# Altium schematic sheet TD4_CPU.SchDoc
size 533 x 393 mm
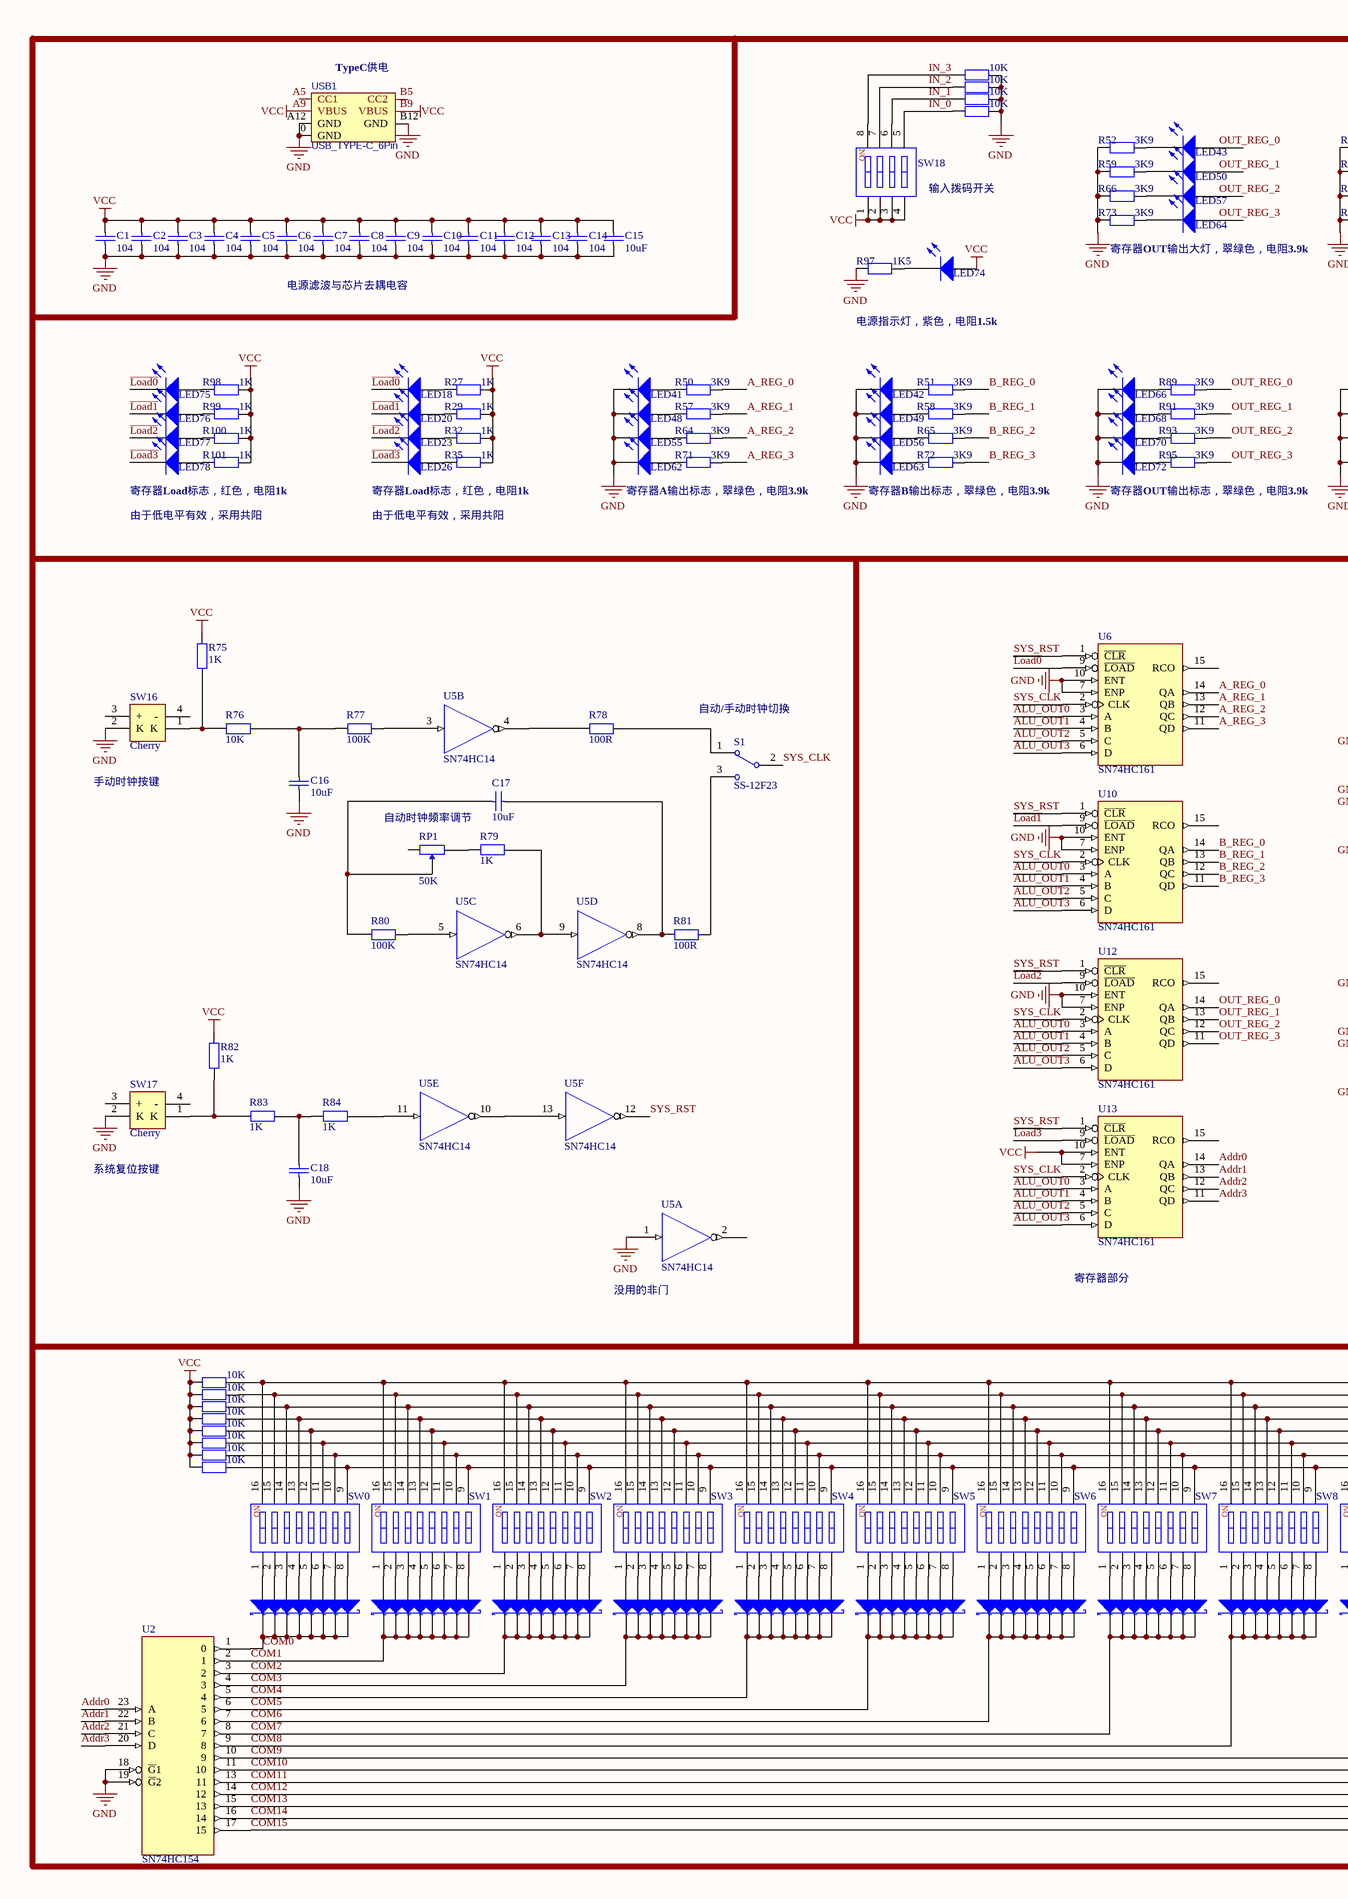
[diagram p0: TD4_CPU.SchDoc, left]
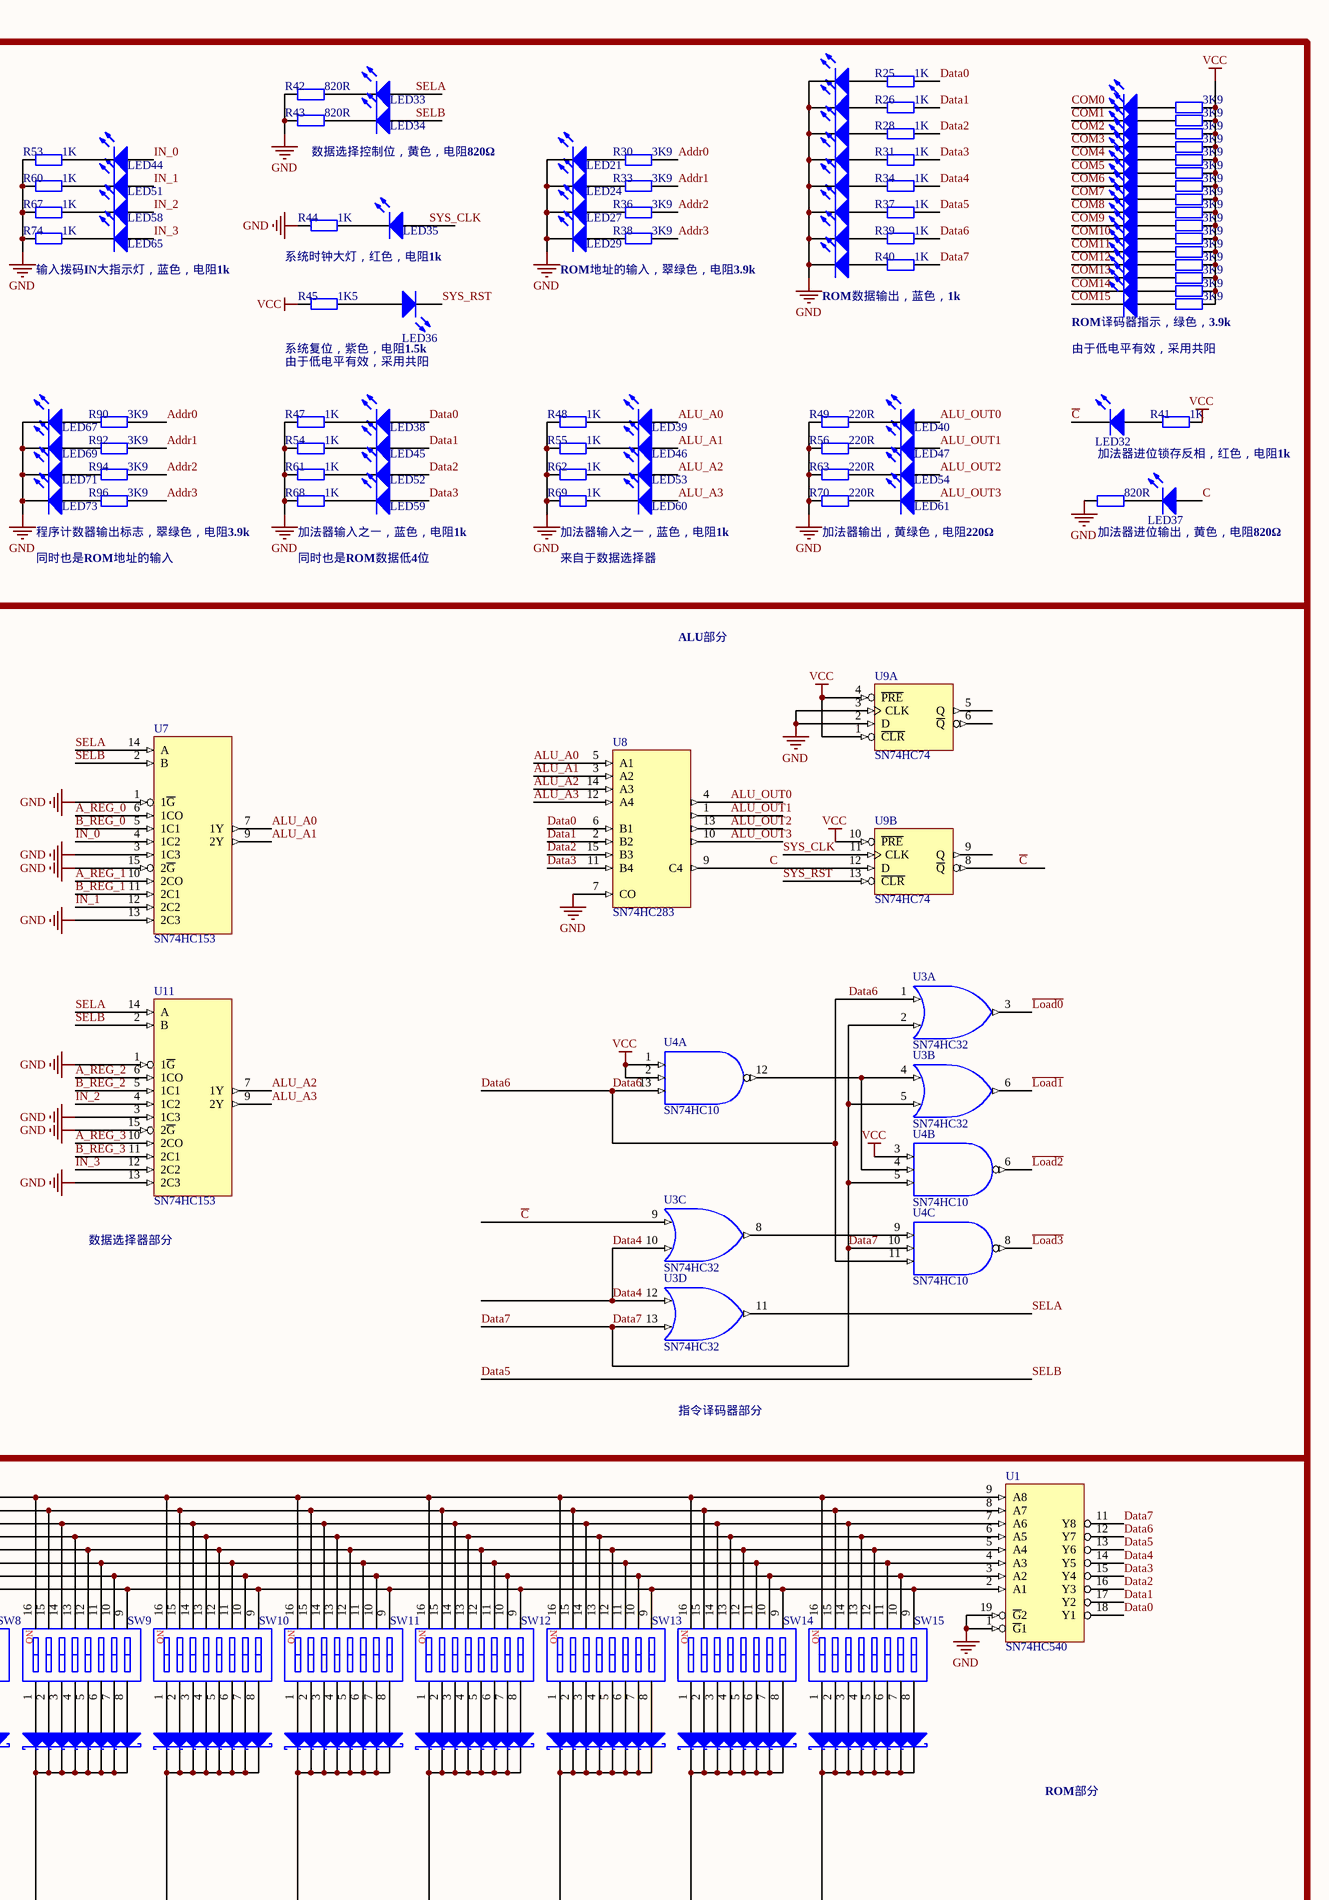
[diagram p1: TD4_CPU.SchDoc, right]

## Parts
C1  104  [C0805_L]
C2  104  [C0805_L]
C3  104  [C0805_L]
C4  104  [C0805_L]
C5  104  [C0805_L]
C6  104  [C0805_L]
C7  104  [C0805_L]
C8  104  [C0805_L]
C9  104  [C0805_L]
C10  104  [C0805_L]
C11  104  [C0805_L]
C12  104  [C0805_L]
C13  104  [C0805_L]
C14  104  [C0805_L]
C15  10uF  [C0805_L]
C16  10uF  [C0805_L]
C17  10uF  [C0805_L]
C18  10uF  [C0805_L]
D1  SS14  [SOD-123]  (value not drawn)
D2  SS14  [SOD-123]  (value not drawn)
D3  SS14  [SOD-123]  (value not drawn)
D4  SS14  [SOD-123]  (value not drawn)
D5  SS14  [SOD-123]  (value not drawn)
D6  SS14  [SOD-123]  (value not drawn)
D7  SS14  [SOD-123]  (value not drawn)
D8  SS14  [SOD-123]  (value not drawn)
D9  SS14  [SOD-123]  (value not drawn)
D10  SS14  [SOD-123]  (value not drawn)
D11  SS14  [SOD-123]  (value not drawn)
D12  SS14  [SOD-123]  (value not drawn)
D13  SS14  [SOD-123]  (value not drawn)
D14  SS14  [SOD-123]  (value not drawn)
D15  SS14  [SOD-123]  (value not drawn)
D16  SS14  [SOD-123]  (value not drawn)
D17  SS14  [SOD-123]  (value not drawn)
D18  SS14  [SOD-123]  (value not drawn)
D19  SS14  [SOD-123]  (value not drawn)
D20  SS14  [SOD-123]  (value not drawn)
D21  SS14  [SOD-123]  (value not drawn)
D22  SS14  [SOD-123]  (value not drawn)
D23  SS14  [SOD-123]  (value not drawn)
D24  SS14  [SOD-123]  (value not drawn)
D25  SS14  [SOD-123]  (value not drawn)
D26  SS14  [SOD-123]  (value not drawn)
D27  SS14  [SOD-123]  (value not drawn)
D28  SS14  [SOD-123]  (value not drawn)
D29  SS14  [SOD-123]  (value not drawn)
D30  SS14  [SOD-123]  (value not drawn)
D31  SS14  [SOD-123]  (value not drawn)
D32  SS14  [SOD-123]  (value not drawn)
D33  SS14  [SOD-123]  (value not drawn)
D34  SS14  [SOD-123]  (value not drawn)
D35  SS14  [SOD-123]  (value not drawn)
D36  SS14  [SOD-123]  (value not drawn)
D37  SS14  [SOD-123]  (value not drawn)
D38  SS14  [SOD-123]  (value not drawn)
D39  SS14  [SOD-123]  (value not drawn)
D40  SS14  [SOD-123]  (value not drawn)
D41  SS14  [SOD-123]  (value not drawn)
D42  SS14  [SOD-123]  (value not drawn)
D43  SS14  [SOD-123]  (value not drawn)
D44  SS14  [SOD-123]  (value not drawn)
D45  SS14  [SOD-123]  (value not drawn)
D46  SS14  [SOD-123]  (value not drawn)
D47  SS14  [SOD-123]  (value not drawn)
D48  SS14  [SOD-123]  (value not drawn)
D49  SS14  [SOD-123]  (value not drawn)
D50  SS14  [SOD-123]  (value not drawn)
D51  SS14  [SOD-123]  (value not drawn)
D52  SS14  [SOD-123]  (value not drawn)
D53  SS14  [SOD-123]  (value not drawn)
D54  SS14  [SOD-123]  (value not drawn)
D55  SS14  [SOD-123]  (value not drawn)
D56  SS14  [SOD-123]  (value not drawn)
D57  SS14  [SOD-123]  (value not drawn)
D58  SS14  [SOD-123]  (value not drawn)
D59  SS14  [SOD-123]  (value not drawn)
D60  SS14  [SOD-123]  (value not drawn)
D61  SS14  [SOD-123]  (value not drawn)
D62  SS14  [SOD-123]  (value not drawn)
D63  SS14  [SOD-123]  (value not drawn)
D64  SS14  [SOD-123]  (value not drawn)
D65  SS14  [SOD-123]  (value not drawn)
D66  SS14  [SOD-123]  (value not drawn)
D67  SS14  [SOD-123]  (value not drawn)
D68  SS14  [SOD-123]  (value not drawn)
D69  SS14  [SOD-123]  (value not drawn)
D70  SS14  [SOD-123]  (value not drawn)
D71  SS14  [SOD-123]  (value not drawn)
D72  SS14  [SOD-123]  (value not drawn)
D73  SS14  [SOD-123]  (value not drawn)
D74  SS14  [SOD-123]  (value not drawn)
D75  SS14  [SOD-123]  (value not drawn)
D76  SS14  [SOD-123]  (value not drawn)
D77  SS14  [SOD-123]  (value not drawn)
D78  SS14  [SOD-123]  (value not drawn)
D79  SS14  [SOD-123]  (value not drawn)
D80  SS14  [SOD-123]  (value not drawn)
D81  SS14  [SOD-123]  (value not drawn)
D82  SS14  [SOD-123]  (value not drawn)
D83  SS14  [SOD-123]  (value not drawn)
D84  SS14  [SOD-123]  (value not drawn)
D85  SS14  [SOD-123]  (value not drawn)
D86  SS14  [SOD-123]  (value not drawn)
D87  SS14  [SOD-123]  (value not drawn)
D88  SS14  [SOD-123]  (value not drawn)
D89  SS14  [SOD-123]  (value not drawn)
D90  SS14  [SOD-123]  (value not drawn)
D91  SS14  [SOD-123]  (value not drawn)
D92  SS14  [SOD-123]  (value not drawn)
D93  SS14  [SOD-123]  (value not drawn)
D94  SS14  [SOD-123]  (value not drawn)
D95  SS14  [SOD-123]  (value not drawn)
D96  SS14  [SOD-123]  (value not drawn)
D97  SS14  [SOD-123]  (value not drawn)
D98  SS14  [SOD-123]  (value not drawn)
D99  SS14  [SOD-123]  (value not drawn)
D100  SS14  [SOD-123]  (value not drawn)
D101  SS14  [SOD-123]  (value not drawn)
D102  SS14  [SOD-123]  (value not drawn)
D103  SS14  [SOD-123]  (value not drawn)
D104  SS14  [SOD-123]  (value not drawn)
D105  SS14  [SOD-123]  (value not drawn)
D106  SS14  [SOD-123]  (value not drawn)
D107  SS14  [SOD-123]  (value not drawn)
D108  SS14  [SOD-123]  (value not drawn)
D109  SS14  [SOD-123]  (value not drawn)
D110  SS14  [SOD-123]  (value not drawn)
D111  SS14  [SOD-123]  (value not drawn)
D112  SS14  [SOD-123]  (value not drawn)
D113  SS14  [SOD-123]  (value not drawn)
D114  SS14  [SOD-123]  (value not drawn)
D115  SS14  [SOD-123]  (value not drawn)
D116  SS14  [SOD-123]  (value not drawn)
D117  SS14  [SOD-123]  (value not drawn)
D118  SS14  [SOD-123]  (value not drawn)
D119  SS14  [SOD-123]  (value not drawn)
D120  SS14  [SOD-123]  (value not drawn)
D121  SS14  [SOD-123]  (value not drawn)
D122  SS14  [SOD-123]  (value not drawn)
D123  SS14  [SOD-123]  (value not drawn)
D124  SS14  [SOD-123]  (value not drawn)
D125  SS14  [SOD-123]  (value not drawn)
D126  SS14  [SOD-123]  (value not drawn)
D127  SS14  [SOD-123]  (value not drawn)
D128  SS14  [SOD-123]  (value not drawn)
LED0  绿色  [LED0805_B]  (value not drawn)
LED1  绿色  [LED0805_B]  (value not drawn)
LED2  绿色  [LED0805_B]  (value not drawn)
LED3  绿色  [LED0805_B]  (value not drawn)
LED4  绿色  [LED0805_B]  (value not drawn)
LED5  绿色  [LED0805_B]  (value not drawn)
LED6  绿色  [LED0805_B]  (value not drawn)
LED7  绿色  [LED0805_B]  (value not drawn)
LED8  绿色  [LED0805_B]  (value not drawn)
LED9  绿色  [LED0805_B]  (value not drawn)
LED10  绿色  [LED0805_B]  (value not drawn)
LED11  绿色  [LED0805_B]  (value not drawn)
LED12  绿色  [LED0805_B]  (value not drawn)
LED13  绿色  [LED0805_B]  (value not drawn)
LED14  绿色  [LED0805_B]  (value not drawn)
LED15  绿色  [LED0805_B]  (value not drawn)
LED16  蓝色  [LED0805_B]  (value not drawn)
LED17  蓝色  [LED0805_B]  (value not drawn)
LED18  红色  [LED0805_B]  (value not drawn)
LED19  蓝色  [LED0805_B]  (value not drawn)
LED20  红色  [LED0805_B]  (value not drawn)
LED21  绿色  [LED0805_B]  (value not drawn)
LED22  蓝色  [LED0805_B]  (value not drawn)
LED23  红色  [LED0805_B]  (value not drawn)
LED24  绿色  [LED0805_B]  (value not drawn)
LED25  蓝色  [LED0805_B]  (value not drawn)
LED26  红色  [LED0805_B]  (value not drawn)
LED27  绿色  [LED0805_B]  (value not drawn)
LED28  蓝色  [LED0805_B]  (value not drawn)
LED29  绿色  [LED0805_B]  (value not drawn)
LED30  蓝色  [LED0805_B]  (value not drawn)
LED31  蓝色  [LED0805_B]  (value not drawn)
LED32  红色  [LED0805_B]  (value not drawn)
LED33  黄色  [LED0805_B]  (value not drawn)
LED34  黄色  [LED0805_B]  (value not drawn)
LED35  红色  [LED F257-W - duplicate]  (value not drawn)
LED36  紫色  [LED0805_B]  (value not drawn)
LED37  黄色  [LED0805_B]  (value not drawn)
LED38  蓝色  [LED0805_B]  (value not drawn)
LED39  红色  [LED0805_B]  (value not drawn)
LED40  黄绿色  [LED0805_B]  (value not drawn)
LED41  绿色  [LED0805_B]  (value not drawn)
LED42  绿色  [LED0805_B]  (value not drawn)
LED43  绿色  [LED F257-W - duplicate]  (value not drawn)
LED44  蓝色  [LED F257-W - duplicate]  (value not drawn)
LED45  蓝色  [LED0805_B]  (value not drawn)
LED46  红色  [LED0805_B]  (value not drawn)
LED47  黄绿色  [LED0805_B]  (value not drawn)
LED48  绿色  [LED0805_B]  (value not drawn)
LED49  绿色  [LED0805_B]  (value not drawn)
LED50  绿色  [LED F257-W - duplicate]  (value not drawn)
LED51  蓝色  [LED F257-W - duplicate]  (value not drawn)
LED52  蓝色  [LED0805_B]  (value not drawn)
LED53  红色  [LED0805_B]  (value not drawn)
LED54  黄绿色  [LED0805_B]  (value not drawn)
LED55  绿色  [LED0805_B]  (value not drawn)
LED56  绿色  [LED0805_B]  (value not drawn)
LED57  绿色  [LED F257-W - duplicate]  (value not drawn)
LED58  蓝色  [LED F257-W - duplicate]  (value not drawn)
LED59  蓝色  [LED0805_B]  (value not drawn)
LED60  红色  [LED0805_B]  (value not drawn)
LED61  黄绿色  [LED0805_B]  (value not drawn)
LED62  绿色  [LED0805_B]  (value not drawn)
LED63  绿色  [LED0805_B]  (value not drawn)
LED64  绿色  [LED F257-W - duplicate]  (value not drawn)
LED65  蓝色  [LED F257-W - duplicate]  (value not drawn)
LED66  绿色  [LED0805_B]  (value not drawn)
LED67  绿色  [LED0805_B]  (value not drawn)
LED68  绿色  [LED0805_B]  (value not drawn)
LED69  绿色  [LED0805_B]  (value not drawn)
LED70  绿色  [LED0805_B]  (value not drawn)
LED71  绿色  [LED0805_B]  (value not drawn)
LED72  绿色  [LED0805_B]  (value not drawn)
LED73  绿色  [LED0805_B]  (value not drawn)
LED74  紫色  [LED0805_B]  (value not drawn)
LED75  红色  [LED0805_B]  (value not drawn)
LED76  红色  [LED0805_B]  (value not drawn)
LED77  红色  [LED0805_B]  (value not drawn)
LED78  红色  [LED0805_B]  (value not drawn)
R1  10K  [R0805_L]
R2  10K  [R0805_L]
R3  10K  [R0805_L]
R4  10K  [R0805_L]
R5  10K  [R0805_L]
R6  10K  [R0805_L]
R7  10K  [R0805_L]
R8  10K  [R0805_L]
R9  3K9  [R0805_L]
R10  3K9  [R0805_L]
R11  3K9  [R0805_L]
R12  3K9  [R0805_L]
R13  3K9  [R0805_L]
R14  3K9  [R0805_L]
R15  3K9  [R0805_L]
R16  3K9  [R0805_L]
R17  3K9  [R0805_L]
R18  3K9  [R0805_L]
R19  3K9  [R0805_L]
R20  3K9  [R0805_L]
R21  3K9  [R0805_L]
R22  3K9  [R0805_L]
R23  3K9  [R0805_L]
R24  3K9  [R0805_L]
R25  1K  [R0805_L]
R26  1K  [R0805_L]
R27  1K  [R0805_L]
R28  1K  [R0805_L]
R29  1K  [R0805_L]
R30  3K9  [R0805_L]
R31  1K  [R0805_L]
R32  1K  [R0805_L]
R33  3K9  [R0805_L]
R34  1K  [R0805_L]
R35  1K  [R0805_L]
R36  3K9  [R0805_L]
R37  1K  [R0805_L]
R38  3K9  [R0805_L]
R39  1K  [R0805_L]
R40  1K  [R0805_L]
R41  1K  [R0805_L]
R42  820R  [R0805_L]
R43  820R  [R0805_L]
R44  1K  [R0805_L]
R45  1K5  [R0805_L]
R46  820R  [R0805_L]
R47  1K  [R0805_L]
R48  1K  [R0805_L]
R49  220R  [R0805_L]
R50  3K9  [R0805_L]
R51  3K9  [R0805_L]
R52  3K9  [R0805_L]
R53  1K  [R0805_L]
R54  1K  [R0805_L]
R55  1K  [R0805_L]
R56  220R  [R0805_L]
R57  3K9  [R0805_L]
R58  3K9  [R0805_L]
R59  3K9  [R0805_L]
R60  1K  [R0805_L]
R61  1K  [R0805_L]
R62  1K  [R0805_L]
R63  220R  [R0805_L]
R64  3K9  [R0805_L]
R65  3K9  [R0805_L]
R66  3K9  [R0805_L]
R67  1K  [R0805_L]
R68  1K  [R0805_L]
R69  1K  [R0805_L]
R70  220R  [R0805_L]
R71  3K9  [R0805_L]
R72  3K9  [R0805_L]
R73  3K9  [R0805_L]
R74  1K  [R0805_L]
R75  1K  [R0805_L]
R76  10K  [R0805_L]
R77  100K  [R0805_L]
R78  100R  [R0805_L]
R79  1K  [R0805_L]
R80  100K  [R0805_L]
R81  100R  [R0805_L]
R82  1K  [R0805_L]
R83  1K  [R0805_L]
R84  1K  [R0805_L]
R85  10K  [R0805_L]
R86  10K  [R0805_L]
R87  10K  [R0805_L]
R88  10K  [R0805_L]
R89  3K9  [R0805_L]
R90  3K9  [R0805_L]
R91  3K9  [R0805_L]
R92  3K9  [R0805_L]
R93  3K9  [R0805_L]
R94  3K9  [R0805_L]
R95  3K9  [R0805_L]
R96  3K9  [R0805_L]
R97  1K5  [R0805_L]
R98  1K  [R0805_L]
R99  1K  [R0805_L]
R100  1K  [R0805_L]
R101  1K  [R0805_L]
RP1  50K  [XV09223NPV-20F]
S1  SS-12F23  [SS-12D10]
SW0  DIP-SW-8P  [SW DIP-8P-B]  (value not drawn)
SW1  DIP-SW-8P  [SW DIP-8P-B]  (value not drawn)
SW2  DIP-SW-8P  [SW DIP-8P-B]  (value not drawn)
SW3  DIP-SW-8P  [SW DIP-8P-B]  (value not drawn)
SW4  DIP-SW-8P  [SW DIP-8P-B]  (value not drawn)
SW5  DIP-SW-8P  [SW DIP-8P-B]  (value not drawn)
SW6  DIP-SW-8P  [SW DIP-8P-B]  (value not drawn)
SW7  DIP-SW-8P  [SW DIP-8P-B]  (value not drawn)
SW8  DIP-SW-8P  [SW DIP-8P-B]  (value not drawn)
SW9  DIP-SW-8P  [SW DIP-8P-B]  (value not drawn)
SW10  DIP-SW-8P  [SW DIP-8P-B]  (value not drawn)
SW11  DIP-SW-8P  [SW DIP-8P-B]  (value not drawn)
SW12  DIP-SW-8P  [SW DIP-8P-B]  (value not drawn)
SW13  DIP-SW-8P  [SW DIP-8P-B]  (value not drawn)
SW14  DIP-SW-8P  [SW DIP-8P-B]  (value not drawn)
SW15  DIP-SW-8P  [SW DIP-8P-B]  (value not drawn)
SW16  Cherry  [LSW DIP-CHERRY-Hat]
SW17  Cherry  [LSW DIP-CHERRY-Hat]
SW18  DIP-SW-4P  [SW DIP-4P-B]  (value not drawn)
U1  SN74HC540  [DIP20-300_MH]
U2  SN74HC154  [DIP24-300_MH]
U3  SN74HC32  [DIP14-300_MH]  (parts A,B,C,D of 4)
U4  SN74HC10  [DIP14-300_MH]  (parts A,B,C of 3)
U5  SN74HC14  [DIP14-300_MH]  (parts A,B,C,D,E,F of 6)
U6  SN74HC161  [DIP16-300_MH]
U7  SN74HC153  [DIP16-300_MH]
U8  SN74HC283  [DIP16-300_MH]
U9  SN74HC74  [DIP14-300_MH]  (parts A,B of 2)
U10  SN74HC161  [DIP16-300_MH]
U11  SN74HC153  [DIP16-300_MH]
U12  SN74HC161  [DIP16-300_MH]
U13  SN74HC161  [DIP16-300_MH]
USB1  USB_TYPE-C_6Pin  [USB-C-SMD_6P]

## Nets
GND: C1.1 C2.1 C3.1 C4.1 C5.1 C6.1 C7.1 C8.1 C9.1 C10.1 C11.1 C12.1 C13.1 C14.1 C15.1 C16.1 C18.1 LED16.2(K) LED17.2(K) LED19.2(K) LED21.2(K) LED22.2(K) LED24.2(K) LED25.2(K) LED27.2(K) LED28.2(K) LED29.2(K) LED30.2(K) LED31.2(K) LED41.2(K) LED42.2(K) LED48.2(K) LED49.2(K) LED55.2(K) LED56.2(K) LED62.2(K) LED63.2(K) LED66.2(K) LED67.2(K) LED68.2(K) LED69.2(K) LED70.2(K) LED71.2(K) LED72.2(K) LED73.2(K) R42.1 R43.1 R44.1 R46.1 R47.1 R48.1 R49.1 R52.1 R53.1 R54.1 R55.1 R56.1 R59.1 R60.1 R61.1 R62.1 R63.1 R66.1 R67.1 R68.1 R69.1 R70.1 R73.1 R74.1 R85.2 R86.2 R87.2 R88.2 R97.1 SW16.2(K) SW17.2(K) U1.1(~{G}1) U1.10(GND) U1.19(~{G}2) U2.12(GND) U2.18(~{G}1) U2.19(~{G}2) U3.7(GND) U4.7(GND) U5.1 U5.7(GND) U6.7(ENP) U6.8(GND) U6.10(ENT) U7.1(1~{G}) U7.3(1C3) U7.8(GND) U7.13(2C3) U7.15(2~{G}) U8.7(CO) U8.8(GND) U9.2(D) U9.3(CLK) U9.7(GND) U10.7(ENP) U10.8(GND) U10.10(ENT) U11.1(1~{G}) U11.3(1C3) U11.8(GND) U11.13(2C3) U11.15(2~{G}) U12.7(ENP) U12.8(GND) U12.10(ENT) U13.8(GND) USB1.0(GND) USB1.A12(GND) USB1.B12(GND)
VCC: C1.2 C2.2 C3.2 C4.2 C5.2 C6.2 C7.2 C8.2 C9.2 C10.2 C11.2 C12.2 C13.2 C14.2 C15.2 LED74.1(A) R1.1 R2.1 R3.1 R4.1 R5.1 R6.1 R7.1 R8.1 R9.2 R10.2 R11.2 R12.2 R13.2 R14.2 R15.2 R16.2 R17.2 R18.2 R19.2 R20.2 R21.2 R22.2 R23.2 R24.2 R27.2 R29.2 R32.2 R35.2 R41.2 R45.1 R75.2 R82.2 R98.2 R99.2 R100.2 R101.2 SW18.1 SW18.2 SW18.3 SW18.4 U1.20(VCC) U2.24(VCC) U3.14(VCC) U4.1 U4.2 U4.3 U4.14(VCC) U5.14(VCC) U6.16(VCC) U7.16(VCC) U8.16(VCC) U9.1(~{CLR}) U9.4(~{PRE}) U9.10(~{PRE}) U9.14(VCC) U10.16(VCC) U11.16(VCC) U12.16(VCC) U13.7(ENP) U13.10(ENT) U13.16(VCC) USB1.A9(VBUS) USB1.B9(VBUS)
A_REG_0: R50.2 U6.14(QA) U7.6(1CO)
A_REG_1: R57.2 U6.13(QB) U7.10(2CO)
A_REG_2: R64.2 U6.12(QC) U11.6(1CO)
A_REG_3: R71.2 U6.11(QD) U11.10(2CO)
Addr0: R30.2 R90.2 U2.23(A) U13.14(QA)
Addr1: R33.2 R92.2 U2.22(B) U13.13(QB)
Addr2: R36.2 R94.2 U2.21(C) U13.12(QC)
Addr3: R38.2 R96.2 U2.20(D) U13.11(QD)
ALU_A0: LED39.1(A) U7.7(1Y) U8.5(A1)
ALU_A1: LED46.1(A) U7.9(2Y) U8.3(A2)
ALU_A2: LED53.1(A) U8.14(A3) U11.7(1Y)
ALU_A3: LED60.1(A) U8.12(A4) U11.9(2Y)
ALU_OUT0: LED40.1(A) U6.3(A) U8.4 U10.3(A) U12.3(A) U13.3(A)
ALU_OUT1: LED47.1(A) U6.4(B) U8.1 U10.4(B) U12.4(B) U13.4(B)
ALU_OUT2: LED54.1(A) U6.5(C) U8.13 U10.5(C) U12.5(C) U13.5(C)
ALU_OUT3: LED61.1(A) U6.6(D) U8.10 U10.6(D) U12.6(D) U13.6(D)
B_REG_0: R51.2 U7.5(1C1) U10.14(QA)
B_REG_1: R58.2 U7.11(2C1) U10.13(QB)
B_REG_2: R65.2 U10.12(QC) U11.5(1C1)
B_REG_3: R72.2 U10.11(QD) U11.11(2C1)
C: LED37.1(A) U8.9(C4) U9.12(D)
~{C}: LED32.2(K) U3.9 U9.8(~{Q})
COM0: D1.2(K) D2.2(K) D3.2(K) D4.2(K) D5.2(K) D6.2(K) D7.2(K) D8.2(K) LED0.2(K) U2.1(0)
COM1: D9.2(K) D10.2(K) D11.2(K) D12.2(K) D13.2(K) D14.2(K) D15.2(K) D16.2(K) LED1.2(K) U2.2(1)
COM2: D17.2(K) D18.2(K) D19.2(K) D20.2(K) D21.2(K) D22.2(K) D23.2(K) D24.2(K) LED2.2(K) U2.3(2)
COM3: D25.2(K) D26.2(K) D27.2(K) D28.2(K) D29.2(K) D30.2(K) D31.2(K) D32.2(K) LED3.2(K) U2.4(3)
COM4: D33.2(K) D34.2(K) D35.2(K) D36.2(K) D37.2(K) D38.2(K) D39.2(K) D40.2(K) LED4.2(K) U2.5(4)
COM5: D41.2(K) D42.2(K) D43.2(K) D44.2(K) D45.2(K) D46.2(K) D47.2(K) D48.2(K) LED5.2(K) U2.6(5)
COM6: D49.2(K) D50.2(K) D51.2(K) D52.2(K) D53.2(K) D54.2(K) D55.2(K) D56.2(K) LED6.2(K) U2.7(6)
COM7: D57.2(K) D58.2(K) D59.2(K) D60.2(K) D61.2(K) D62.2(K) D63.2(K) D64.2(K) LED7.2(K) U2.8(7)
COM8: D65.2(K) D66.2(K) D67.2(K) D68.2(K) D69.2(K) D70.2(K) D71.2(K) D72.2(K) LED8.2(K) U2.9(8)
COM9: D73.2(K) D74.2(K) D75.2(K) D76.2(K) D77.2(K) D78.2(K) D79.2(K) D80.2(K) LED9.2(K) U2.10(9)
COM10: D81.2(K) D82.2(K) D83.2(K) D84.2(K) D85.2(K) D86.2(K) D87.2(K) D88.2(K) LED10.2(K) U2.11(10)
COM11: D89.2(K) D90.2(K) D91.2(K) D92.2(K) D93.2(K) D94.2(K) D95.2(K) D96.2(K) LED11.2(K) U2.13(11)
COM12: D97.2(K) D98.2(K) D99.2(K) D100.2(K) D101.2(K) D102.2(K) D103.2(K) D104.2(K) LED12.2(K) U2.14(12)
COM13: D105.2(K) D106.2(K) D107.2(K) D108.2(K) D109.2(K) D110.2(K) D111.2(K) D112.2(K) LED13.2(K) U2.15(13)
COM14: D113.2(K) D114.2(K) D115.2(K) D116.2(K) D117.2(K) D118.2(K) D119.2(K) D120.2(K) LED14.2(K) U2.16(14)
COM15: D121.2(K) D122.2(K) D123.2(K) D124.2(K) D125.2(K) D126.2(K) D127.2(K) D128.2(K) LED15.2(K) U2.17(15)
Data0: LED38.1(A) R25.2 U1.18(Y1) U8.6(B1)
Data1: LED45.1(A) R26.2 U1.17(Y2) U8.2(B2)
Data2: LED52.1(A) R28.2 U1.16(Y3) U8.15(B3)
Data3: LED59.1(A) R31.2 U1.15(Y4) U8.11(B4)
Data4: R34.2 U1.14(Y5) U3.10 U3.12
Data5: LED34.1(A) R37.2 U1.13(Y6) U7.2(B) U11.2(B)  [also labelled SELB]
Data6: R39.2 U1.12(Y7) U3.1 U4.11 U4.13
Data7: R40.2 U1.11(Y8) U3.2 U3.5 U3.13 U4.5 U4.10
IN_0: LED44.1(A) R88.1 SW18.5 U7.4(1C2)
IN_1: LED51.1(A) R87.1 SW18.6 U7.12(2C2)
IN_2: LED58.1(A) R86.1 SW18.7 U11.4(1C2)
IN_3: LED65.1(A) R85.1 SW18.8 U11.12(2C2)
~{Load0}: LED18.2(K) LED75.2(K) U3.3 U6.9(~{LOAD})
~{Load1}: LED20.2(K) LED76.2(K) U3.6 U10.9(~{LOAD})
~{Load2}: LED23.2(K) LED77.2(K) U4.6 U12.9(~{LOAD})
~{Load3}: LED26.2(K) LED78.2(K) U4.8 U13.9(~{LOAD})
OUT_REG_0: LED43.1(A) R89.2 U12.14(QA)
OUT_REG_1: LED50.1(A) R91.2 U12.13(QB)
OUT_REG_2: LED57.1(A) R93.2 U12.12(QC)
OUT_REG_3: LED64.1(A) R95.2 U12.11(QD)
SELA: LED33.1(A) U3.11 U7.14(A) U11.14(A)
SYS_CLK: LED35.1(A) S1.2 U6.2(CLK) U9.11(CLK) U10.2(CLK) U12.2(CLK) U13.2(CLK)
SYS_RST: LED36.2(K) U5.12 U6.1(~{CLR}) U9.13(~{CLR}) U10.1(~{CLR}) U12.1(~{CLR}) U13.1(~{CLR})
NetC16_2: C16.2 R76.2 R77.1
NetC17_1: C17.1 R81.1 U5.8
NetC17_2: C17.2 R80.1 RP1.2
NetC18_2: C18.2 R83.2 R84.1
NetD1_1: D1.1(A) SW0.1
NetD2_1: D2.1(A) SW0.2
NetD3_1: D3.1(A) SW0.3
NetD4_1: D4.1(A) SW0.4
NetD5_1: D5.1(A) SW0.5
NetD6_1: D6.1(A) SW0.6
NetD7_1: D7.1(A) SW0.7
NetD8_1: D8.1(A) SW0.8
NetD9_1: D9.1(A) SW1.1
NetD10_1: D10.1(A) SW1.2
NetD11_1: D11.1(A) SW1.3
NetD12_1: D12.1(A) SW1.4
NetD13_1: D13.1(A) SW1.5
NetD14_1: D14.1(A) SW1.6
NetD15_1: D15.1(A) SW1.7
NetD16_1: D16.1(A) SW1.8
NetD17_1: D17.1(A) SW2.1
NetD18_1: D18.1(A) SW2.2
NetD19_1: D19.1(A) SW2.3
NetD20_1: D20.1(A) SW2.4
NetD21_1: D21.1(A) SW2.5
NetD22_1: D22.1(A) SW2.6
NetD23_1: D23.1(A) SW2.7
NetD24_1: D24.1(A) SW2.8
NetD25_1: D25.1(A) SW3.1
NetD26_1: D26.1(A) SW3.2
NetD27_1: D27.1(A) SW3.3
NetD28_1: D28.1(A) SW3.4
NetD29_1: D29.1(A) SW3.5
NetD30_1: D30.1(A) SW3.6
NetD31_1: D31.1(A) SW3.7
NetD32_1: D32.1(A) SW3.8
NetD33_1: D33.1(A) SW4.1
NetD34_1: D34.1(A) SW4.2
NetD35_1: D35.1(A) SW4.3
NetD36_1: D36.1(A) SW4.4
NetD37_1: D37.1(A) SW4.5
NetD38_1: D38.1(A) SW4.6
NetD39_1: D39.1(A) SW4.7
NetD40_1: D40.1(A) SW4.8
NetD41_1: D41.1(A) SW5.1
NetD42_1: D42.1(A) SW5.2
NetD43_1: D43.1(A) SW5.3
NetD44_1: D44.1(A) SW5.4
NetD45_1: D45.1(A) SW5.5
NetD46_1: D46.1(A) SW5.6
NetD47_1: D47.1(A) SW5.7
NetD48_1: D48.1(A) SW5.8
NetD49_1: D49.1(A) SW6.1
NetD50_1: D50.1(A) SW6.2
NetD51_1: D51.1(A) SW6.3
NetD52_1: D52.1(A) SW6.4
NetD53_1: D53.1(A) SW6.5
NetD54_1: D54.1(A) SW6.6
NetD55_1: D55.1(A) SW6.7
NetD56_1: D56.1(A) SW6.8
NetD57_1: D57.1(A) SW7.1
NetD58_1: D58.1(A) SW7.2
NetD59_1: D59.1(A) SW7.3
NetD60_1: D60.1(A) SW7.4
NetD61_1: D61.1(A) SW7.5
NetD62_1: D62.1(A) SW7.6
NetD63_1: D63.1(A) SW7.7
NetD64_1: D64.1(A) SW7.8
NetD65_1: D65.1(A) SW8.1
NetD66_1: D66.1(A) SW8.2
NetD67_1: D67.1(A) SW8.3
NetD68_1: D68.1(A) SW8.4
NetD69_1: D69.1(A) SW8.5
NetD70_1: D70.1(A) SW8.6
NetD71_1: D71.1(A) SW8.7
NetD72_1: D72.1(A) SW8.8
NetD73_1: D73.1(A) SW9.1
NetD74_1: D74.1(A) SW9.2
NetD75_1: D75.1(A) SW9.3
NetD76_1: D76.1(A) SW9.4
NetD77_1: D77.1(A) SW9.5
NetD78_1: D78.1(A) SW9.6
NetD79_1: D79.1(A) SW9.7
NetD80_1: D80.1(A) SW9.8
NetD81_1: D81.1(A) SW10.1
NetD82_1: D82.1(A) SW10.2
NetD83_1: D83.1(A) SW10.3
NetD84_1: D84.1(A) SW10.4
NetD85_1: D85.1(A) SW10.5
NetD86_1: D86.1(A) SW10.6
NetD87_1: D87.1(A) SW10.7
NetD88_1: D88.1(A) SW10.8
NetD89_1: D89.1(A) SW11.1
NetD90_1: D90.1(A) SW11.2
NetD91_1: D91.1(A) SW11.3
NetD92_1: D92.1(A) SW11.4
NetD93_1: D93.1(A) SW11.5
NetD94_1: D94.1(A) SW11.6
NetD95_1: D95.1(A) SW11.7
NetD96_1: D96.1(A) SW11.8
NetD97_1: D97.1(A) SW12.1
NetD98_1: D98.1(A) SW12.2
NetD99_1: D99.1(A) SW12.3
NetD100_1: D100.1(A) SW12.4
NetD101_1: D101.1(A) SW12.5
NetD102_1: D102.1(A) SW12.6
NetD103_1: D103.1(A) SW12.7
NetD104_1: D104.1(A) SW12.8
NetD105_1: D105.1(A) SW13.1
NetD106_1: D106.1(A) SW13.2
NetD107_1: D107.1(A) SW13.3
NetD108_1: D108.1(A) SW13.4
NetD109_1: D109.1(A) SW13.5
NetD110_1: D110.1(A) SW13.6
NetD111_1: D111.1(A) SW13.7
NetD112_1: D112.1(A) SW13.8
NetD113_1: D113.1(A) SW14.1
NetD114_1: D114.1(A) SW14.2
NetD115_1: D115.1(A) SW14.3
NetD116_1: D116.1(A) SW14.4
NetD117_1: D117.1(A) SW14.5
NetD118_1: D118.1(A) SW14.6
NetD119_1: D119.1(A) SW14.7
NetD120_1: D120.1(A) SW14.8
NetD121_1: D121.1(A) SW15.1
NetD122_1: D122.1(A) SW15.2
NetD123_1: D123.1(A) SW15.3
NetD124_1: D124.1(A) SW15.4
NetD125_1: D125.1(A) SW15.5
NetD126_1: D126.1(A) SW15.6
NetD127_1: D127.1(A) SW15.7
NetD128_1: D128.1(A) SW15.8
NetLED0_1: LED0.1(A) R9.1
NetLED1_1: LED1.1(A) R10.1
NetLED2_1: LED2.1(A) R11.1
NetLED3_1: LED3.1(A) R12.1
NetLED4_1: LED4.1(A) R13.1
NetLED5_1: LED5.1(A) R14.1
NetLED6_1: LED6.1(A) R15.1
NetLED7_1: LED7.1(A) R16.1
NetLED8_1: LED8.1(A) R17.1
NetLED9_1: LED9.1(A) R18.1
NetLED10_1: LED10.1(A) R19.1
NetLED11_1: LED11.1(A) R20.1
NetLED12_1: LED12.1(A) R21.1
NetLED13_1: LED13.1(A) R22.1
NetLED14_1: LED14.1(A) R23.1
NetLED15_1: LED15.1(A) R24.1
NetLED16_1: LED16.1(A) R25.1
NetLED17_1: LED17.1(A) R26.1
NetLED18_1: LED18.1(A) R27.1
NetLED19_1: LED19.1(A) R28.1
NetLED20_1: LED20.1(A) R29.1
NetLED21_1: LED21.1(A) R30.1
NetLED22_1: LED22.1(A) R31.1
NetLED23_1: LED23.1(A) R32.1
NetLED24_1: LED24.1(A) R33.1
NetLED25_1: LED25.1(A) R34.1
NetLED26_1: LED26.1(A) R35.1
NetLED27_1: LED27.1(A) R36.1
NetLED28_1: LED28.1(A) R37.1
NetLED29_1: LED29.1(A) R38.1
NetLED30_1: LED30.1(A) R39.1
NetLED31_1: LED31.1(A) R40.1
NetLED32_1: LED32.1(A) R41.1
NetLED33_2: LED33.2(K) R42.2
NetLED34_2: LED34.2(K) R43.2
NetLED35_2: LED35.2(K) R44.2
NetLED36_1: LED36.1(A) R45.2
NetLED37_2: LED37.2(K) R46.2
NetLED38_2: LED38.2(K) R47.2
NetLED39_2: LED39.2(K) R48.2
NetLED40_2: LED40.2(K) R49.2
NetLED41_1: LED41.1(A) R50.1
NetLED42_1: LED42.1(A) R51.1
NetLED43_2: LED43.2(K) R52.2
NetLED44_2: LED44.2(K) R53.2
NetLED45_2: LED45.2(K) R54.2
NetLED46_2: LED46.2(K) R55.2
NetLED47_2: LED47.2(K) R56.2
NetLED48_1: LED48.1(A) R57.1
NetLED49_1: LED49.1(A) R58.1
NetLED50_2: LED50.2(K) R59.2
NetLED51_2: LED51.2(K) R60.2
NetLED52_2: LED52.2(K) R61.2
NetLED53_2: LED53.2(K) R62.2
NetLED54_2: LED54.2(K) R63.2
NetLED55_1: LED55.1(A) R64.1
NetLED56_1: LED56.1(A) R65.1
NetLED57_2: LED57.2(K) R66.2
NetLED58_2: LED58.2(K) R67.2
NetLED59_2: LED59.2(K) R68.2
NetLED60_2: LED60.2(K) R69.2
NetLED61_2: LED61.2(K) R70.2
NetLED62_1: LED62.1(A) R71.1
NetLED63_1: LED63.1(A) R72.1
NetLED64_2: LED64.2(K) R73.2
NetLED65_2: LED65.2(K) R74.2
NetLED66_1: LED66.1(A) R89.1
NetLED67_1: LED67.1(A) R90.1
NetLED68_1: LED68.1(A) R91.1
NetLED69_1: LED69.1(A) R92.1
NetLED70_1: LED70.1(A) R93.1
NetLED71_1: LED71.1(A) R94.1
NetLED72_1: LED72.1(A) R95.1
NetLED73_1: LED73.1(A) R96.1
NetLED74_2: LED74.2(K) R97.2
NetLED75_1: LED75.1(A) R98.1
NetLED76_1: LED76.1(A) R99.1
NetLED77_1: LED77.1(A) R100.1
NetLED78_1: LED78.1(A) R101.1
NetR1_2: R1.2 SW0.16 SW1.16 SW2.16 SW3.16 SW4.16 SW5.16 SW6.16 SW7.16 SW8.16 SW9.16 SW10.16 SW11.16 SW12.16 SW13.16 SW14.16 SW15.16 U1.9(A8)
NetR2_2: R2.2 SW0.15 SW1.15 SW2.15 SW3.15 SW4.15 SW5.15 SW6.15 SW7.15 SW8.15 SW9.15 SW10.15 SW11.15 SW12.15 SW13.15 SW14.15 SW15.15 U1.8(A7)
NetR3_2: R3.2 SW0.14 SW1.14 SW2.14 SW3.14 SW4.14 SW5.14 SW6.14 SW7.14 SW8.14 SW9.14 SW10.14 SW11.14 SW12.14 SW13.14 SW14.14 SW15.14 U1.7(A6)
NetR4_2: R4.2 SW0.13 SW1.13 SW2.13 SW3.13 SW4.13 SW5.13 SW6.13 SW7.13 SW8.13 SW9.13 SW10.13 SW11.13 SW12.13 SW13.13 SW14.13 SW15.13 U1.6(A5)
NetR5_2: R5.2 SW0.12 SW1.12 SW2.12 SW3.12 SW4.12 SW5.12 SW6.12 SW7.12 SW8.12 SW9.12 SW10.12 SW11.12 SW12.12 SW13.12 SW14.12 SW15.12 U1.5(A4)
NetR6_2: R6.2 SW0.11 SW1.11 SW2.11 SW3.11 SW4.11 SW5.11 SW6.11 SW7.11 SW8.11 SW9.11 SW10.11 SW11.11 SW12.11 SW13.11 SW14.11 SW15.11 U1.4(A3)
NetR7_2: R7.2 SW0.10 SW1.10 SW2.10 SW3.10 SW4.10 SW5.10 SW6.10 SW7.10 SW8.10 SW9.10 SW10.10 SW11.10 SW12.10 SW13.10 SW14.10 SW15.10 U1.3(A2)
NetR8_2: R8.2 SW0.9 SW1.9 SW2.9 SW3.9 SW4.9 SW5.9 SW6.9 SW7.9 SW8.9 SW9.9 SW10.9 SW11.9 SW12.9 SW13.9 SW14.9 SW15.9 U1.2(A1)
NetR75_1: R75.1 R76.1 SW16.1(K)
NetR77_2: R77.2 U5.3
NetR78_1: R78.1 U5.4
NetR78_2: R78.2 S1.1
NetR79_1: R79.1 RP1.3
NetR79_2: R79.2 U5.6 U5.9
NetR80_2: R80.2 U5.5
NetR81_2: R81.2 S1.3
NetR82_1: R82.1 R83.1 SW17.1(K)
NetR84_2: R84.2 U5.11
NetU3_4: U3.4 U4.4 U4.12
NetU3_8: U3.8 U4.9
NetU5_10: U5.10 U5.13

Not connected (* = marked no-connect by the designer): RP1 1; SW16 3(+) 4(-); SW17 3(+) 4(-); U5 2; U6 15(RCO); U9 5(Q) 6(~{Q}) 9(Q); U10 15(RCO); U12 15(RCO); U13 15(RCO); USB1 A5(CC1) B5(CC2)

## Notes on the sheet
- (near USB1) TypeC供电
- 数据选择控制位，黄色，电阻820Ω
- (near SW18) 输入拨码开关
- 寄存器OUT输出大灯，翠绿色，电阻3.9k
- 输入拨码IN大指示灯，蓝色，电阻1k
- 系统时钟大灯，红色，电阻1k
- ROM地址的输入，翠绿色，电阻3.9k
- ROM数据输出，蓝色，1k
- 电源滤波与芯片去耦电容
- 电源指示灯，紫色，电阻1.5k
- 系统复位，紫色，电阻1.5k
- 由于低电平有效，采用共阳
- ROM译码器指示，绿色，3.9k
- 加法器进位锁存反相，红色，电阻1k
- 寄存器Load标志，红色，电阻1k
- 寄存器A输出标志，翠绿色，电阻3.9k
- 寄存器B输出标志，翠绿色，电阻3.9k
- 寄存器OUT输出标志，翠绿色，电阻3.9k
- 程序计数器输出标志，翠绿色，电阻3.9k
- 同时也是ROM地址的输入
- 加法器输入之一，蓝色，电阻1k
- 同时也是ROM数据低4位
- 来自于数据选择器
- 加法器输出，黄绿色，电阻220Ω
- 加法器进位输出，黄色，电阻820Ω
- ALU部分
- (near S1) 自动/手动时钟切换
- 手动时钟按键
- (near RP1) 自动时钟频率调节
- 系统复位按键
- 数据选择器部分
- 没用的非门
- 寄存器部分
- 指令译码器部分
- ROM部分
- (in symbol DIP-SW-4P) NO
- (in symbol DIP-SW-8P) NO

## Library data of the parts
C1-C18 = C: 贴片电容/MLCC电容; BOM名称: 无极性贴片电容; 联系下单店铺卖家 免费帮你查找封装: 联系下单店铺卖家 免费技术支持
D1-D128 = SS14: 肖特基二极管; 属性: 40V/1A; 当前库版本V2022.10.7 @淘宝卖家:黄晶宝石: 最新版本发布https://shop463601444.taobao.com; BOM名称: 肖特基二极管
LED0-LED78 = LED: 贴片LED; 封装库来自淘宝卖家：黄晶宝石: 其他店铺购入均为盗版封装库，无更新权益，退款现金奖励200~1000元; BOM名称: 贴片LED
R1-R101 = R: 贴片电阻; 当前库版本V2022.10.7 @黄晶宝石: 最新版本发布https://shop463601444.taobao.com; BOM名称: 贴片电阻
RP1 = RP: 单联电位器; BOM名称: 插件电位器; 联系下单店铺卖家 免费帮你查找封装: 联系下单店铺卖家 免费技术支持
S1 = SSW-1P: 1路波动开关; BOM名称: 波动开关; 联系下单店铺卖家 免费技术支持: 联系下单店铺卖家 免费帮你查找封装
SW0-SW15 = DIP-SW-8P: 8路编码开关; 联系下单店铺卖家 免费技术支持: 联系下单店铺卖家 免费帮你查找封装; BOM名称: 8路编码开关
SW16 SW17 = LSW: 带灯机械按键开关; 联系下单店铺卖家 免费技术支持: 联系下单店铺卖家 免费帮你查找封装; BOM名称: 带灯机械按键开关
SW18 = DIP-SW-4P: 4路编码开关; 联系下单店铺卖家 免费技术支持: 联系下单店铺卖家 免费帮你查找封装; BOM名称: 4路编码开关
U1 = SN74HC540: OCTAL BUF AND LINE DRV 3SO; 封装库来自淘宝卖家：黄晶宝石: 最新版本发布https://shop463601444.taobao.com
U2 = SN74HC154: 4-16LINE DEC DEMUL; 封装库来自淘宝卖家：黄晶宝石: 最新版本发布https://shop463601444.taobao.com
U3 = SN74HC32: Quad 2-IN Pos Or G; 封装库来自淘宝卖家：黄晶宝石: 最新版本发布https://shop463601444.taobao.com
U4 = SN74HC10: Triple 3-IN Pos Nand G; 封装库来自淘宝卖家：黄晶宝石: 最新版本发布https://shop463601444.taobao.com
U5 = SN74HC14: Hex Inverter SCH; 封装库来自淘宝卖家：黄晶宝石: 最新版本发布https://shop463601444.taobao.com
U6 U10 U12 U13 = SN74HC161: SYN 4-BIT CNT; 封装库来自淘宝卖家：黄晶宝石: 最新版本发布https://shop463601444.taobao.com
U7 U11 = SN74HC153: DUAL 4-1 LINE DATA SELEC/MUX; 封装库来自淘宝卖家：黄晶宝石: 最新版本发布https://shop463601444.taobao.com
U8 = SN74HC283: 4-BIT BIN ADD WITH FC; 封装库来自淘宝卖家：黄晶宝石: 最新版本发布https://shop463601444.taobao.com
U9 = SN74HC74: DUAL D PET FF RS CR; 封装库来自淘宝卖家：黄晶宝石: 最新版本发布https://shop463601444.taobao.com
USB1 = USB_TYPE-C_6Pin: USB_TYPE-C_6Pin母座; 当前库版本V2022.10.7 @淘宝卖家:黄晶宝石: 最新版本发布https://shop463601444.taobao.com